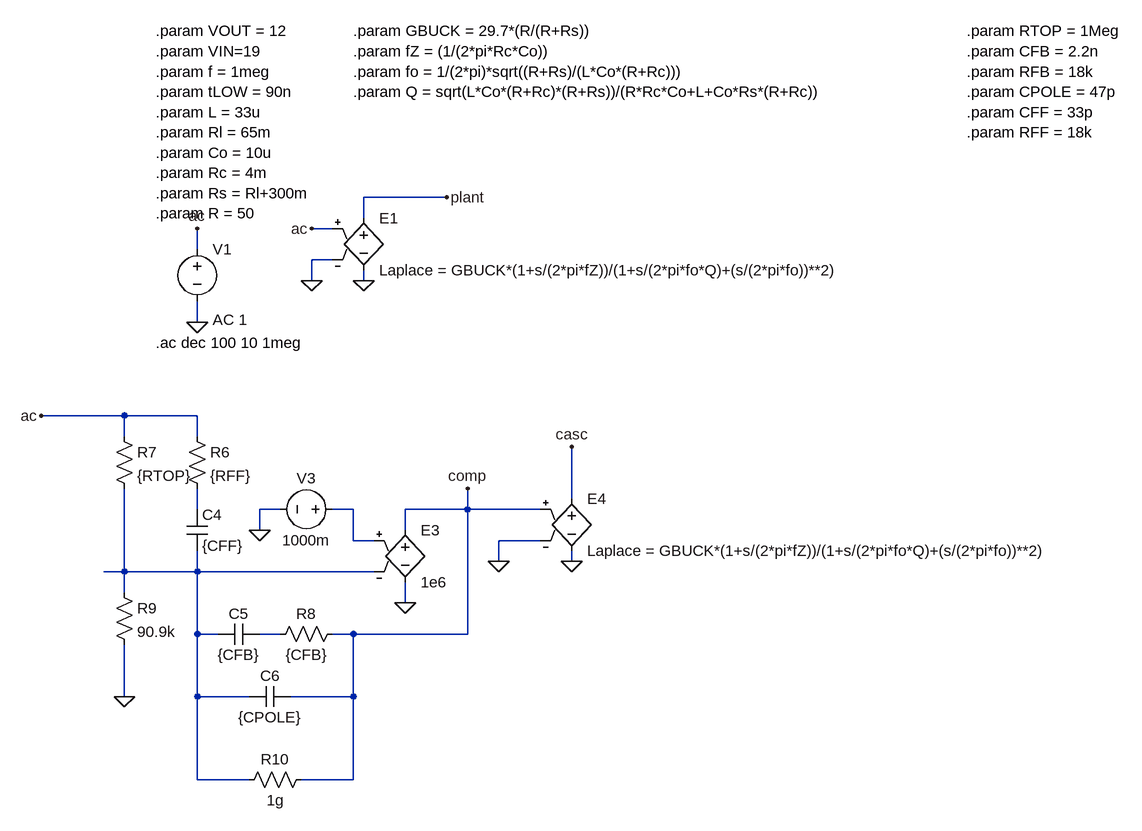
[diagram p0: schematic ltc3115-1-tf-buck.asc]
ltc3115-1-tf-buck.asc, the LTspice schematic file:
Version 4.1
SHEET 1 2660 992
WIRE 272 48 144 48
WIRE 144 80 144 48
WIRE 96 96 64 96
WIRE -112 128 -112 96
WIRE 96 144 64 144
WIRE 64 176 64 144
WIRE 144 176 144 160
WIRE -112 240 -112 208
WIRE -224 384 -352 384
WIRE -112 384 -224 384
WIRE -224 416 -224 384
WIRE -112 416 -112 384
WIRE 464 512 464 432
WIRE -112 528 -112 496
WIRE 16 528 -16 528
WIRE 128 528 96 528
WIRE 304 528 304 496
WIRE 304 528 208 528
WIRE 416 528 304 528
WIRE -16 560 -16 528
WIRE 208 560 208 528
WIRE 128 576 128 528
WIRE 160 576 128 576
WIRE 416 576 352 576
WIRE 352 608 352 576
WIRE 464 608 464 592
WIRE -224 624 -224 496
WIRE -224 624 -256 624
WIRE -112 624 -112 592
WIRE -112 624 -224 624
WIRE 160 624 -112 624
WIRE -224 656 -224 624
WIRE 208 672 208 640
WIRE -112 720 -112 624
WIRE -80 720 -112 720
WIRE 16 720 -16 720
WIRE 128 720 96 720
WIRE 304 720 304 528
WIRE 304 720 128 720
WIRE -224 816 -224 736
WIRE -112 816 -112 720
WIRE -32 816 -112 816
WIRE 128 816 128 720
WIRE 128 816 32 816
WIRE -112 944 -112 816
WIRE -32 944 -112 944
WIRE 128 944 128 816
WIRE 128 944 48 944
FLAG 64 176 0
FLAG -112 96 ac
FLAG 64 96 ac
FLAG -112 240 0
FLAG 144 176 0
FLAG 272 48 plant
FLAG -224 816 0
FLAG -16 560 0
FLAG 208 672 0
FLAG 304 496 comp
FLAG -352 384 ac
FLAG 352 608 0
FLAG 464 608 0
FLAG 464 432 casc
SYMBOL voltage -112 112 R0
WINDOW 123 24 124 Left 2
WINDOW 39 0 0 Left 0
SYMATTR Value2 AC 1
SYMATTR InstName V1
SYMATTR Value ""
SYMBOL e 144 64 R0
SYMATTR InstName E1
SYMATTR Value Laplace = GBUCK*(1+s/(2*pi*fZ))/(1+s/(2*pi*fo*Q)+(s/(2*pi*fo))**2)
SYMBOL cap -128 528 R0
SYMATTR InstName C4
SYMATTR Value {CFF}
SYMBOL res -128 400 R0
SYMATTR InstName R6
SYMATTR Value {RFF}
SYMBOL res -240 400 R0
SYMATTR InstName R7
SYMATTR Value {RTOP}
SYMBOL cap -16 704 R90
WINDOW 0 0 32 VBottom 2
WINDOW 3 32 32 VTop 2
SYMATTR InstName C5
SYMATTR Value {CFB}
SYMBOL res 112 704 R90
WINDOW 0 0 56 VBottom 2
WINDOW 3 32 56 VTop 2
SYMATTR InstName R8
SYMATTR Value {CFB}
SYMBOL cap 32 800 R90
WINDOW 0 0 32 VBottom 2
WINDOW 3 32 32 VTop 2
SYMATTR InstName C6
SYMATTR Value {CPOLE}
SYMBOL res -240 640 R0
SYMATTR InstName R9
SYMATTR Value 90.9k
SYMBOL voltage 112 528 R90
WINDOW 0 -32 56 VBottom 2
WINDOW 3 32 56 VTop 2
WINDOW 123 0 0 Left 0
WINDOW 39 0 0 Left 0
SYMATTR InstName V3
SYMATTR Value 1000m
SYMBOL e 208 544 R0
SYMATTR InstName E3
SYMATTR Value 1e6
SYMBOL res 64 928 R90
WINDOW 0 0 56 VBottom 2
WINDOW 3 32 56 VTop 2
SYMATTR InstName R10
SYMATTR Value 1g
SYMBOL e 464 496 R0
SYMATTR InstName E4
SYMATTR Value Laplace = GBUCK*(1+s/(2*pi*fZ))/(1+s/(2*pi*fo*Q)+(s/(2*pi*fo))**2)
TEXT -176 -208 Left 2 !.param VOUT = 12\n.param VIN=19\n.param f = 1meg\n.param tLOW = 90n\n.param L = 33u\n.param Rl = 65m\n.param Co = 10u\n.param Rc = 4m\n.param Rs = Rl+300m\n.param R = 50
TEXT 128 -208 Left 2 !.param GBUCK = 29.7*(R/(R+Rs))\n.param fZ = (1/(2*pi*Rc*Co))\n.param fo = 1/(2*pi)*sqrt((R+Rs)/(L*Co*(R+Rc)))\n.param Q = sqrt(L*Co*(R+Rc)*(R+Rs))/(R*Rc*Co+L+Co*Rs*(R+Rc))
TEXT -176 272 Left 2 !.ac dec 100 10 1meg
TEXT 1072 -208 Left 2 !.param RTOP = 1Meg\n.param CFB = 2.2n\n.param RFB = 18k\n.param CPOLE = 47p\n.param CFF = 33p\n.param RFF = 18k

The netlist it stands for:
* ltc3115-1-tf-buck.asc
V1 ac 0 AC 1
E1 plant 0 ac 0 Laplace = GBUCK*(1+s/(2*pi*fZ))/(1+s/(2*pi*fo*Q)+(s/(2*pi*fo))**2)
C4 N001 N003 {CFF}
R6 ac N001 {RFF}
R7 ac N003 {RTOP}
C5 N004 N003 {CFB}
R8 comp N004 {CFB}
C6 comp N003 {CPOLE}
R9 N003 0 90.9k
V3 N002 0 1000m
E3 comp 0 N002 N003 1e6
R10 comp N003 1g
E4 casc 0 comp 0 Laplace = GBUCK*(1+s/(2*pi*fZ))/(1+s/(2*pi*fo*Q)+(s/(2*pi*fo))**2)
.param VOUT = 12
.param VIN=19
.param f = 1meg
.param tLOW = 90n
.param L = 33u
.param Rl = 65m
.param Co = 10u
.param Rc = 4m
.param Rs = Rl+300m
.param R = 50
.param GBUCK = 29.7*(R/(R+Rs))
.param fZ = (1/(2*pi*Rc*Co))
.param fo = 1/(2*pi)*sqrt((R+Rs)/(L*Co*(R+Rc)))
.param Q = sqrt(L*Co*(R+Rc)*(R+Rs))/(R*Rc*Co+L+Co*Rs*(R+Rc))
.ac dec 100 10 1meg
.param RTOP = 1Meg
.param CFB = 2.2n
.param RFB = 18k
.param CPOLE = 47p
.param CFF = 33p
.param RFF = 18k
.backanno
.end